# Altium project SISPS-PV-PCB.PrjPcb (part 1 of 4)
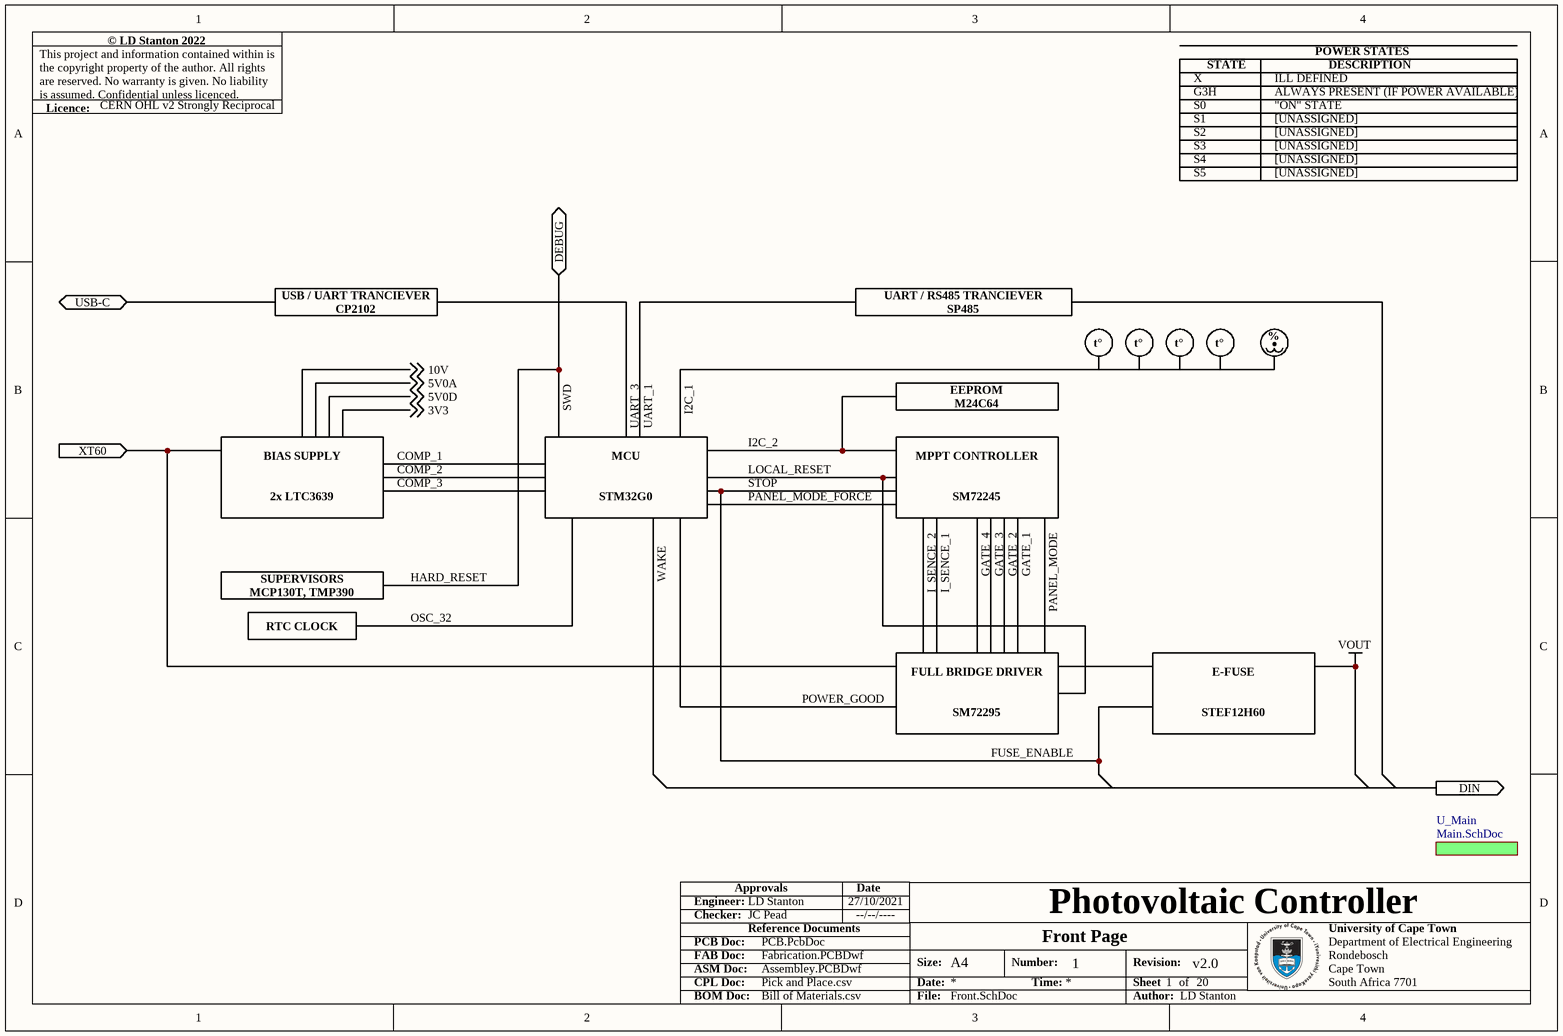
[diagram p0: Front.SchDoc]
Approv_Date_Chk: --/--/----; Approv_Date_Eng: 27/10/2021; ASM_DOC: Assembley.PCBDwf; BOM_DOC: Bill of Materials.csv; Checker: JC Pead; CPL_DOC: Pick and Place.csv; DwgTitleLine1: SISPS-PV; DwgTitleLine2: Photovoltaic MPPT Converter; FAB_DOC: Fabrication.PCBDwf; Licence: CERN OHL v2 Strongly Reciprocal; PCB_DOC: PCB.PcbDoc; Project_Revision: v2.0; Rev_Date_1: 18/10/2021; Rev_Date_2: 27/10/2021; Rev_Date_3: --/--/----; Rev_Date_4: --/--/----; Rev_Desc_1: Initial Prototype; Rev_Desc_2: Change to JLCPCB; Rev_Desc_3: - - - - -; Rev_Desc_4: - - - - -; Rev_No_1: v1.0; Rev_No_2: v1.2; Rev_No_3: -; Rev_No_4: -; SCH_DOC: Main.SchDoc
20 sheets, 532 parts. Net scope: hierarchical (ports join the sheet entries above them; power ports are global).
Board file: PCB.PcbDoc
Sheets:
  Front.SchDoc
    U_Main = Main.SchDoc
      U_MCU = MCU.SchDoc
        U_RS485 Tranciever = RS485 Tranciever.SchDoc
        U_EEPROM = EEPROM.SchDoc
        U_Sensors = Sensors.SchDoc
      U_Connectors = Connectors.SchDoc
      U_Controller = Controller.SchDoc
      U_Bridge Regulator = Bridge Regulator.SchDoc
        U_Panel Mode Switch = Panel Mode Switch.SchDoc
        U_E-Fuse = E-Fuse.SchDoc
      U_Bias Regulators 1 = Bias Regulators 1.SchDoc
      U_Bias Regulators 2 = Bias Regulators 2.SchDoc
      U_Backplane = Backplane.SchDoc
      U_Mechanical = Mechanical.SchDoc
      U_USB-UART Converter (CP2102) = USB-UART Converter (CP2102).SchDoc
  USB-UART Converter (FT232).SchDoc
  Illustrations 1.SchDoc
  Illustrations 2.SchDoc
  Simulation 1.SchDoc

## Sheet Front.SchDoc: Front Page
size A4; ApprovedBy: LD Stanton; Author: LD Stanton; CompanyName: University of Cape Town; DrawnBy: Lawrence Stanton; Engineer: LD Stanton; Organization: University of Cape Town; Address1: Department of Electrical Engineering; Address2: Rondebosch; Address3: Cape Town; Address4: South Africa 7701; DocumentNumber: 1; SheetNumber: 1; SheetTotal: 20; Project_Name: Photovoltaic Controller

### Parts
(Parts that share a designator on the sheet are numbered #1, #2 ... from top to bottom, then left to right.)
?#1  Text Box Small 2 Line Extra Wide Illustration  (value not drawn)  (graphical)
?#2  Text Box Small 2 Line 2X Wide Illustration  (value not drawn)  (graphical)
?#3  Text Box Small 2 Line Extra Wide Illustration  (value not drawn)  (graphical)
?#4  Text Box Large 2 Line Illustration  (value not drawn)  (graphical)
?#5  Text Box Large 2 Line Illustration  (value not drawn)  (graphical)
?#6  Text Box Large 2 Line Illustration  (value not drawn)  (graphical)
?#7  Text Box Small 2 Line Extra Wide Illustration  (value not drawn)  (graphical)
?#8  Text Box Small 1 Line Wide Illustration  (value not drawn)  (graphical)
?#9  Text Box Large 2 Line Illustration  (value not drawn)  (graphical)
?#10  Text Box Large 2 Line Illustration  (value not drawn)  (graphical)
M?#1  Thermometer Illustration  (value not drawn)  (graphical)
M?#2  Thermometer Illustration  (value not drawn)  (graphical)
M?#3  Thermometer Illustration  (value not drawn)  (graphical)
M?#4  Thermometer Illustration  (value not drawn)  (graphical)
M?#5  Humidity Illustration  (value not drawn)  (graphical)

### Sub-sheets
U_Main = Main.SchDoc: no entries

### Ports
DEBUG (bidir), DIN (out), USB-C (bidir), XT60 (in)

### Nets
VOUT: ?#10.35
3V3: ?#4.31 ; off-sheet 3V3
5V0A: ?#4.29 ; off-sheet 5V0A
5V0D: ?#4.30 ; off-sheet 5V0D
10V: ?#4.28 ; off-sheet 10V
COMP_1: ?#4.36 ?#5.58
COMP_2: ?#4.37 ?#5.56
COMP_3: ?#4.38 ?#5.54 ?#5.55
FUSE_ENABLE: ?#5.38 ?#6.54 ?#6.55 ?#10.54 ?#10.55  [also labelled STOP]
GATE_1: ?#6.43 ?#9.31
GATE_2: ?#6.44 ?#9.30
GATE_3: ?#6.45 ?#9.29
GATE_4: ?#6.46 ?#9.28
HARD_RESET: ?#5.23 ?#7.23 ; port DEBUG  [also labelled SWD]
I2C_1: ?#5.32 M?#1.1 M?#2.1 M?#3.1 M?#4.1 M?#5.1
I2C_2: ?#3.26 ?#5.35 ?#5.36 ?#6.57 ?#6.58
I_SENCE_1: ?#6.49 ?#9.25
I_SENCE_2: ?#6.50 ?#9.24
LOCAL_RESET: ?#5.37 ?#6.56 ?#9.37
OSC_32: ?#5.50 ?#8.7
PANEL_MODE: ?#6.41 ?#9.33
PANEL_MODE_FORCE: ?#5.39 ?#6.53
POWER_GOOD: ?#5.42 ?#9.54 ?#9.55
UART_1: ?#2.31 ?#5.29 ?#5.30
UART_3: ?#1.23 ?#5.25 ?#5.26 ?#5.27 ?#5.28
WAKE: ?#5.44
Net?#1_10: ?#1.10 ?#1.11 ?#1.12 ?#1.18
Net?#1_26: ?#1.26 ; port USB-C
Net?#4_54: ?#4.54 ?#4.55
Net?#4_57: ?#4.57 ?#9.57 ; port XT60
Net?#9_35: ?#9.35 ?#9.36 ?#10.57

Not connected (* = marked no-connect by the designer): ?#1 2 3 4 5 6 8 9 14 15 16 17 19 20 21 22 24 25 27 28 29 30 31; ?#2 2 3 4 5 6 8 9 10 11 12 14 15 16 17 18 19 20 21 22 24 25 27 28 29 30 32 33 34 35 36 37 38 39 40 41; ?#3 2 3 4 5 6 8 9 10 11 12 14 15 16 17 18 19 20 21 22 23 24 25 27 28 29 30 31; ?#4 22 23 24 25 26 27 32 33 34 35 39 40 41 42 43 44 45 46 47 48 49 50 51 52 53 56 58; ?#5 22 24 31 33 34 40 41 43 45 46 47 48 49 51 52 53 57; ?#6 22 23 24 25 26 27 28 29 30 31 32 33 34 35 36 37 38 39 40 42 47 48 51 52; ?#7 2 3 4 5 6 8 9 10 11 12 14 15 16 17 18 19 20 21 22 24 25 26 27 28 29 30 31; ?#8 2 3 4 5 6 8 9 10 11 12 13 14 15 16 17 18 19 20 21; ?#9 22 23 26 27 32 34 38 39 40 41 42 43 44 45 46 47 48 49 50 51 52 53 56; ?#10 22 23 24 25 26 27 28 29 30 31 32 33 34 36 37 38 39 40 41 42 43 44 45 46 47 48 49 50 51 52 53 56

### Notes on the sheet
- G3H
- S0
- X
- STATE
- ALWAYS PRESENT (IF POWER AVAILABLE)
- "ON" STATE
- ILL DEFINED
- POWER STATES
- DESCRIPTION
- S1
- S2
- S3
- S4
- S5
- [UNASSIGNED]
- © LD Stanton 2022
- This project and information contained within is the copyright property of the author. All rights are reserved. No warranty is given. No liability is assumed. Confidential unless licenced.
- Licence:
- Engineer:
- Checker:
- Approvals
- Date
- PCB Doc:
- ASM Doc:
- FAB Doc:
- CPL Doc:
- Reference Documents
- Size:
- Date:
- A4
- Number:
- Time:
- Revision:
- Sheet
- of
- BOM Doc:
- File:
- Author:
- (in symbol CMP-00041-1) t°
- (in symbol CMP-00087-1) %

### Library data of the parts
?#1 = CMP-00085-2: Generic Text Box Extra Wide 2 Line Wide for Illustration; Line2: CP2102; Line1: USB / UART TRANCIEVER
?#2 = CMP-00086-1: Generic Text Box 2X Wide 2 Line Wide for Illustration; Line1: UART / RS485 TRANCIEVER; Line2: SP485
?#3 = CMP-00085-2: Generic Text Box Extra Wide 2 Line Wide for Illustration; Line2: M24C64; Line1: EEPROM
?#4 = CMP-00080-3: Generic Text Box Large 2 Line for Illustration; Line2: 2x LTC3639; Line1: BIAS SUPPLY
?#5 = CMP-00080-3: Generic Text Box Large 2 Line for Illustration; Line2: STM32G0; Line1: MCU
?#6 = CMP-00080-3: Generic Text Box Large 2 Line for Illustration; Line2: SM72245; Line1: MPPT CONTROLLER
?#7 = CMP-00085-2: Generic Text Box Extra Wide 2 Line Wide for Illustration; Line2: MCP130T, TMP390; Line1: SUPERVISORS
?#8 = CMP-00088-1: Generic Text Box Small 1 Line Wide for Illustration; Line1: RTC CLOCK
?#9 = CMP-00080-2: Generic Text Box Large 2 Line for Illustration; Line2: SM72295; Line1: FULL BRIDGE DRIVER
?#10 = CMP-00080-2: Generic Text Box Large 2 Line for Illustration; Line2: STEF12H60; Line1: E-FUSE
M?#1-M?#4 = CMP-00041-1: Thermometer for Illustration; Placement: CRITICAL
M?#5 = CMP-00087-1: Humidity Sensor for Illustration; Placement: CRITICAL

## Sheet Main.SchDoc: Main Schematic
size A3; ApprovedBy: LD Stanton; CheckedBy: None; Author: LD Stanton; DrawnBy: LD Stanton; Engineer: LD Stanton; Organization: University of Cape Town; Address1: Department of Electrical Engineering; Address2: Menzies Building, Upper Campus; Address3: Cape Town, South Africa; Address4: 7701; DocumentNumber: 2; Revision: v1.0; SheetNumber: 2; SheetTotal: 20; Project_Name: Photovoltaic Controller
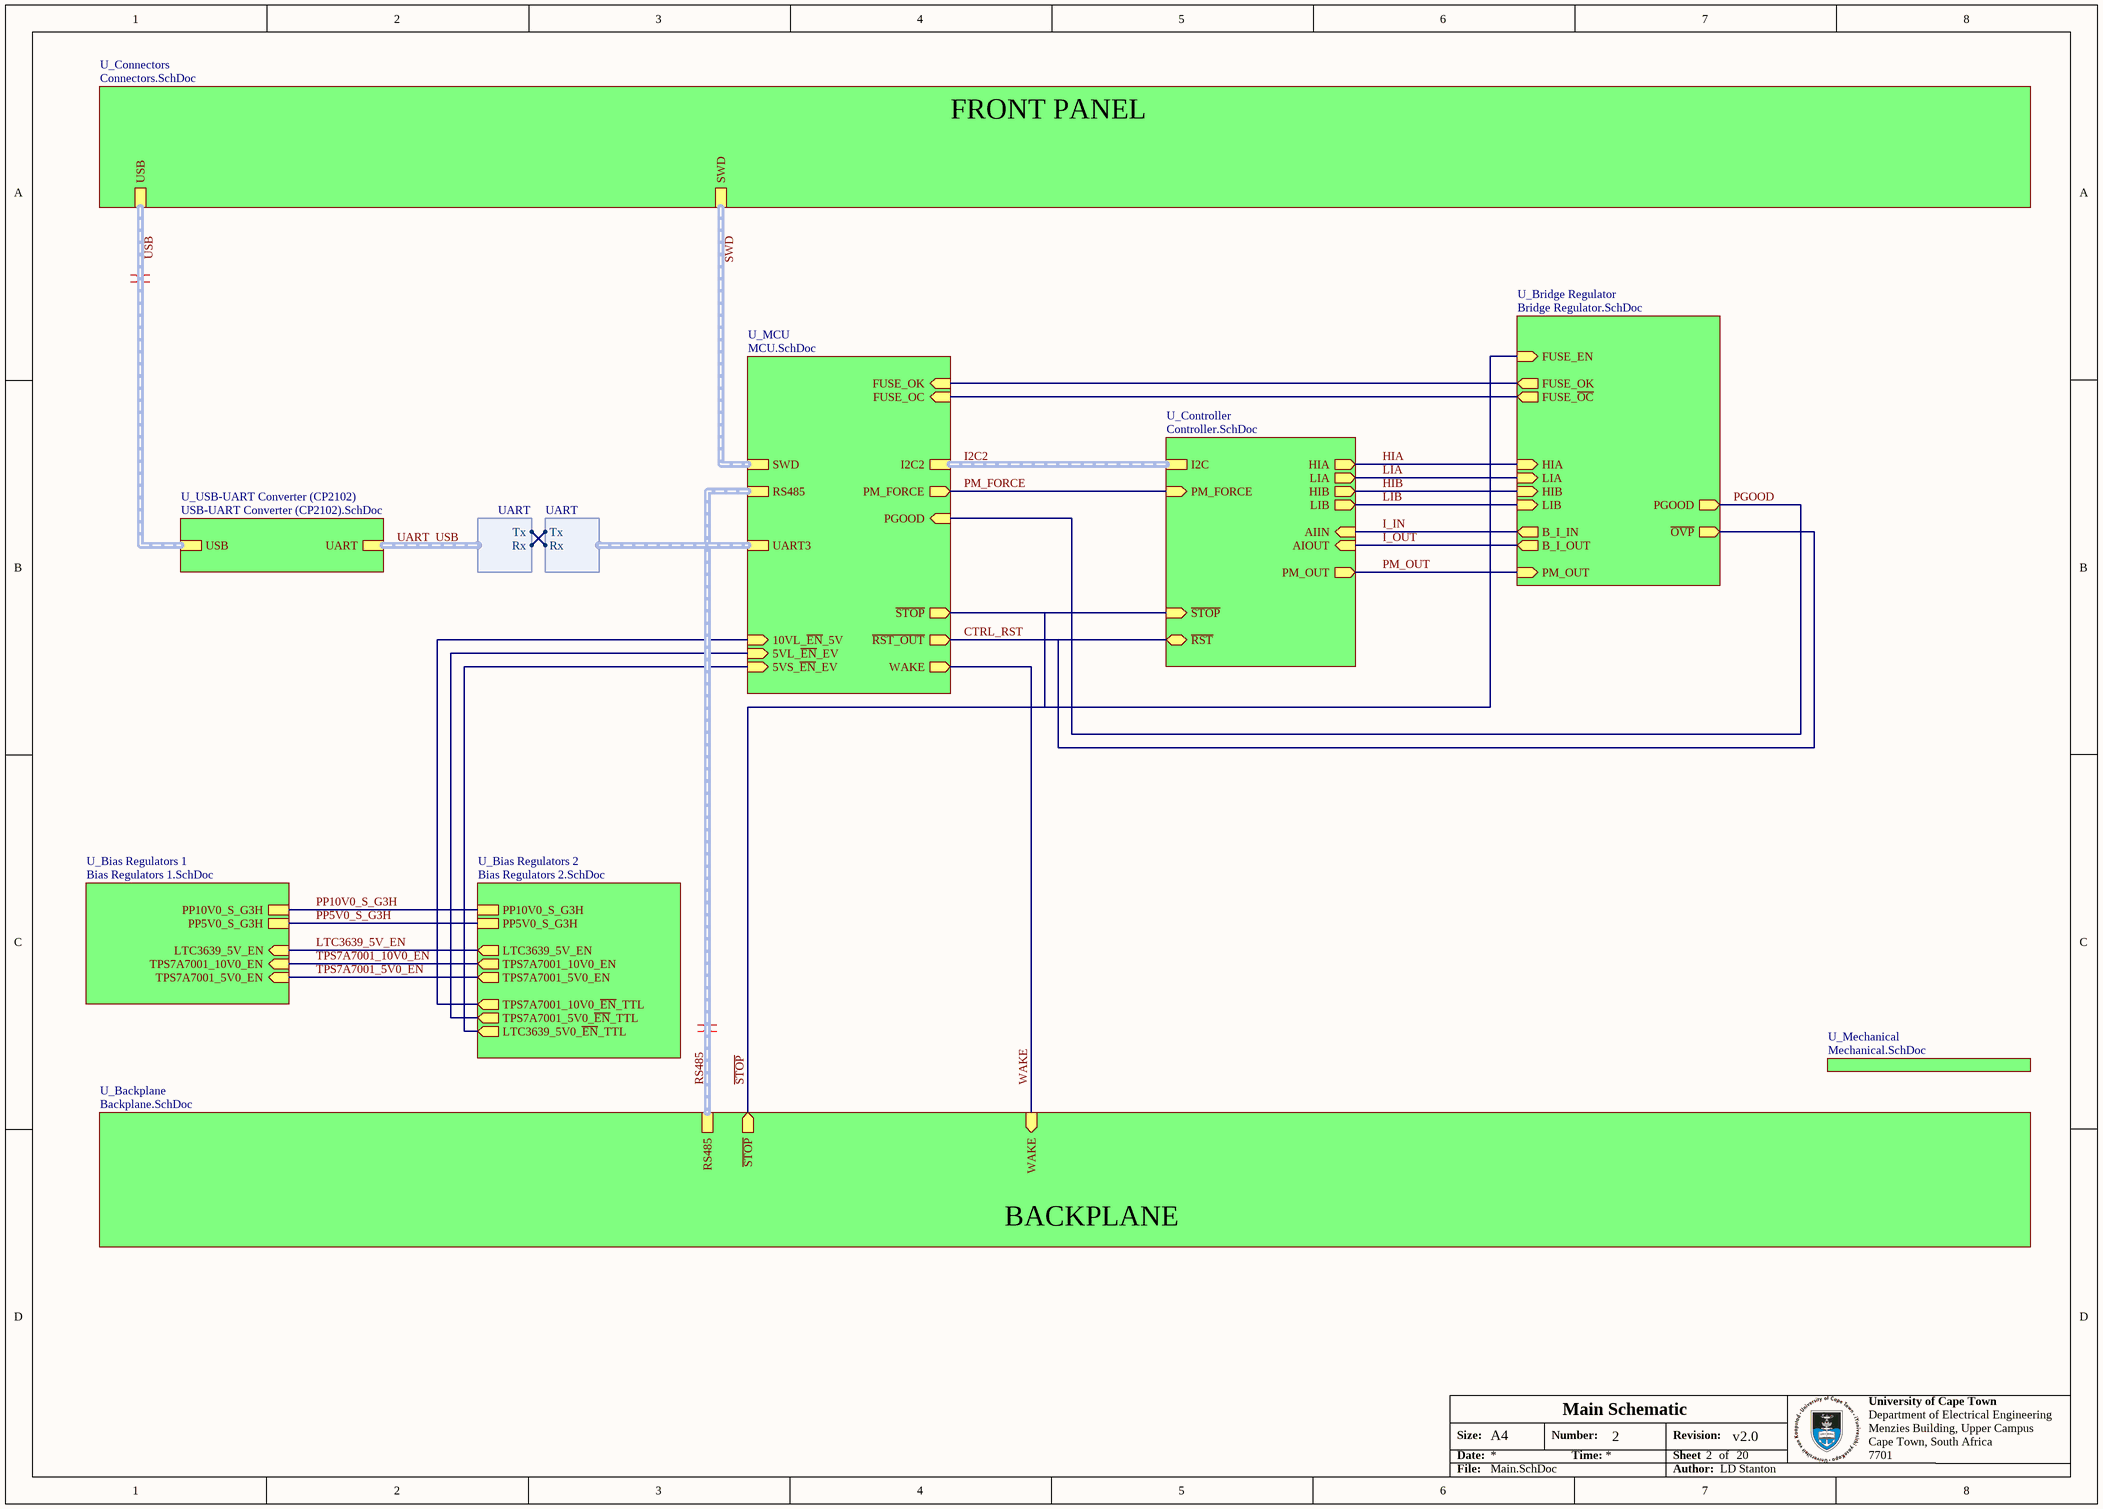
[diagram p1: Main.SchDoc]

### Sub-sheets
U_Backplane = Backplane.SchDoc: RS485 (harness RS485), ~{STOP} (out), WAKE (in)
U_Bias Regulators 1 = Bias Regulators 1.SchDoc: PP10V0_S_G3H, TPS7A7001_5V0_EN (in), LTC3639_5V_EN (in), TPS7A7001_10V0_EN (in), PP5V0_S_G3H
U_Bias Regulators 2 = Bias Regulators 2.SchDoc: PP5V0_S_G3H, PP10V0_S_G3H, LTC3639_5V_EN (out), TPS7A7001_10V0_EN (out), TPS7A7001_5V0_EN (out), TPS7A7001_10V0_~{EN}_TTL (out), LTC3639_5V0_~{EN}_TTL (out), TPS7A7001_5V0_~{EN}_TTL (out)
U_Bridge Regulator = Bridge Regulator.SchDoc: LIA (in), HIA (in), HIB (in), LIB (in), B_I_IN (out), B_I_OUT (out), PGOOD (out), ~{OVP} (out), PM_OUT (in), FUSE_EN (in), FUSE_OK (out), FUSE_~{OC} (out)
U_Connectors = Connectors.SchDoc: USB (harness USB), SWD (harness SWD)
U_Controller = Controller.SchDoc: LIB (out), HIA (out), I2C (harness I2C), PM_OUT (out), AIIN (in), AIOUT (in), ~{RST} (bidir), HIB (out), LIA (out), PM_FORCE (in), ~{STOP} (in)
U_MCU = MCU.SchDoc: SWD (harness SWD), UART3 (harness UART), ~{RST_OUT} (out), PM_FORCE (out), WAKE (out), RS485 (harness RS485), I2C2 (harness I2C), FUSE_OK (in), ~{STOP} (out), FUSE_OC (in), PGOOD (in), 5VS_~{EN}_EV (in), 10VL_~{EN}_5V (in), 5VL_~{EN}_EV (in)
U_Mechanical = Mechanical.SchDoc: no entries
U_USB-UART Converter (CP2102) = USB-UART Converter (CP2102).SchDoc: USB (harness USB), UART (harness UART)

### Harnesses
UART: Rx, Tx

### Nets
~{STOP}: sheet U_MCU/~{STOP}, sheet U_Controller/~{STOP}, sheet U_Bridge Regulator/FUSE_EN, sheet U_Backplane/~{STOP}
CTRL_RST: sheet U_MCU/~{RST_OUT}, sheet U_Controller/~{RST}, sheet U_Bridge Regulator/~{OVP}
FUSE_OC: sheet U_MCU/FUSE_OC, sheet U_Bridge Regulator/FUSE_~{OC}
FUSE_OK: sheet U_MCU/FUSE_OK, sheet U_Bridge Regulator/FUSE_OK
HIA: sheet U_Controller/HIA, sheet U_Bridge Regulator/HIA
HIB: sheet U_Controller/HIB, sheet U_Bridge Regulator/HIB
I_IN: sheet U_Controller/AIIN, sheet U_Bridge Regulator/B_I_IN
I_OUT: sheet U_Controller/AIOUT, sheet U_Bridge Regulator/B_I_OUT
LIA: sheet U_Controller/LIA, sheet U_Bridge Regulator/LIA
LIB: sheet U_Controller/LIB, sheet U_Bridge Regulator/LIB
LTC3639_5V_EN: sheet U_Bias Regulators 1/LTC3639_5V_EN, sheet U_Bias Regulators 2/LTC3639_5V_EN
PGOOD: sheet U_MCU/PGOOD, sheet U_Bridge Regulator/PGOOD
PM_FORCE: sheet U_MCU/PM_FORCE, sheet U_Controller/PM_FORCE
PM_OUT: sheet U_Controller/PM_OUT, sheet U_Bridge Regulator/PM_OUT
PP5V0_S_G3H: sheet U_Bias Regulators 1/PP5V0_S_G3H, sheet U_Bias Regulators 2/PP5V0_S_G3H
PP10V0_S_G3H: sheet U_Bias Regulators 1/PP10V0_S_G3H, sheet U_Bias Regulators 2/PP10V0_S_G3H
TPS7A7001_5V0_EN: sheet U_Bias Regulators 1/TPS7A7001_5V0_EN, sheet U_Bias Regulators 2/TPS7A7001_5V0_EN
TPS7A7001_10V0_EN: sheet U_Bias Regulators 1/TPS7A7001_10V0_EN, sheet U_Bias Regulators 2/TPS7A7001_10V0_EN
UART_USB.Rx: sheet U_USB-UART Converter (CP2102)/UART.Rx, sheet U_MCU/UART3.Tx
UART_USB.Tx: sheet U_USB-UART Converter (CP2102)/UART.Tx, sheet U_MCU/UART3.Rx
WAKE: sheet U_MCU/WAKE, sheet U_Backplane/WAKE
NetR408_2: sheet U_MCU/5VS_~{EN}_EV, sheet U_Bias Regulators 2/LTC3639_5V0_~{EN}_TTL
NetR409_2: sheet U_MCU/5VL_~{EN}_EV, sheet U_Bias Regulators 2/TPS7A7001_5V0_~{EN}_TTL
NetR410_2: sheet U_MCU/10VL_~{EN}_5V, sheet U_Bias Regulators 2/TPS7A7001_10V0_~{EN}_TTL

### Buses and harness runs
harness I2C2 = sheet U_Controller/I2C = sheet U_MCU/I2C2
harness RS485 = sheet U_Backplane/RS485 = sheet U_MCU/RS485
harness SWD = sheet U_Connectors/SWD = sheet U_MCU/SWD
harness UART_USB = sheet U_USB-UART Converter (CP2102)/UART
harness USB = sheet U_Connectors/USB = sheet U_USB-UART Converter (CP2102)/USB

### Layout directives
differential pair: (no net found under the mark)

### Notes on the sheet
- FRONT PANEL
- BACKPLANE
- Size:
- Date:
- A4
- Number:
- Time:
- Revision:
- Sheet
- of
- File:
- Author:

## Sheet MCU.SchDoc: MCU
size A3; ApprovedBy: LD Stanton; Author: LD Stanton; CompanyName: University of Cape Town; DrawnBy: Lawrence Stanton; Engineer: Lawrence Stanton; Organization: University of Cape Town; Address1: Department of Electrical Engineering; Address2: Rondebosch; Address3: Cape Town; Address4: South Africa 7701; DocumentNumber: 11; SheetNumber: 11; SheetTotal: 20
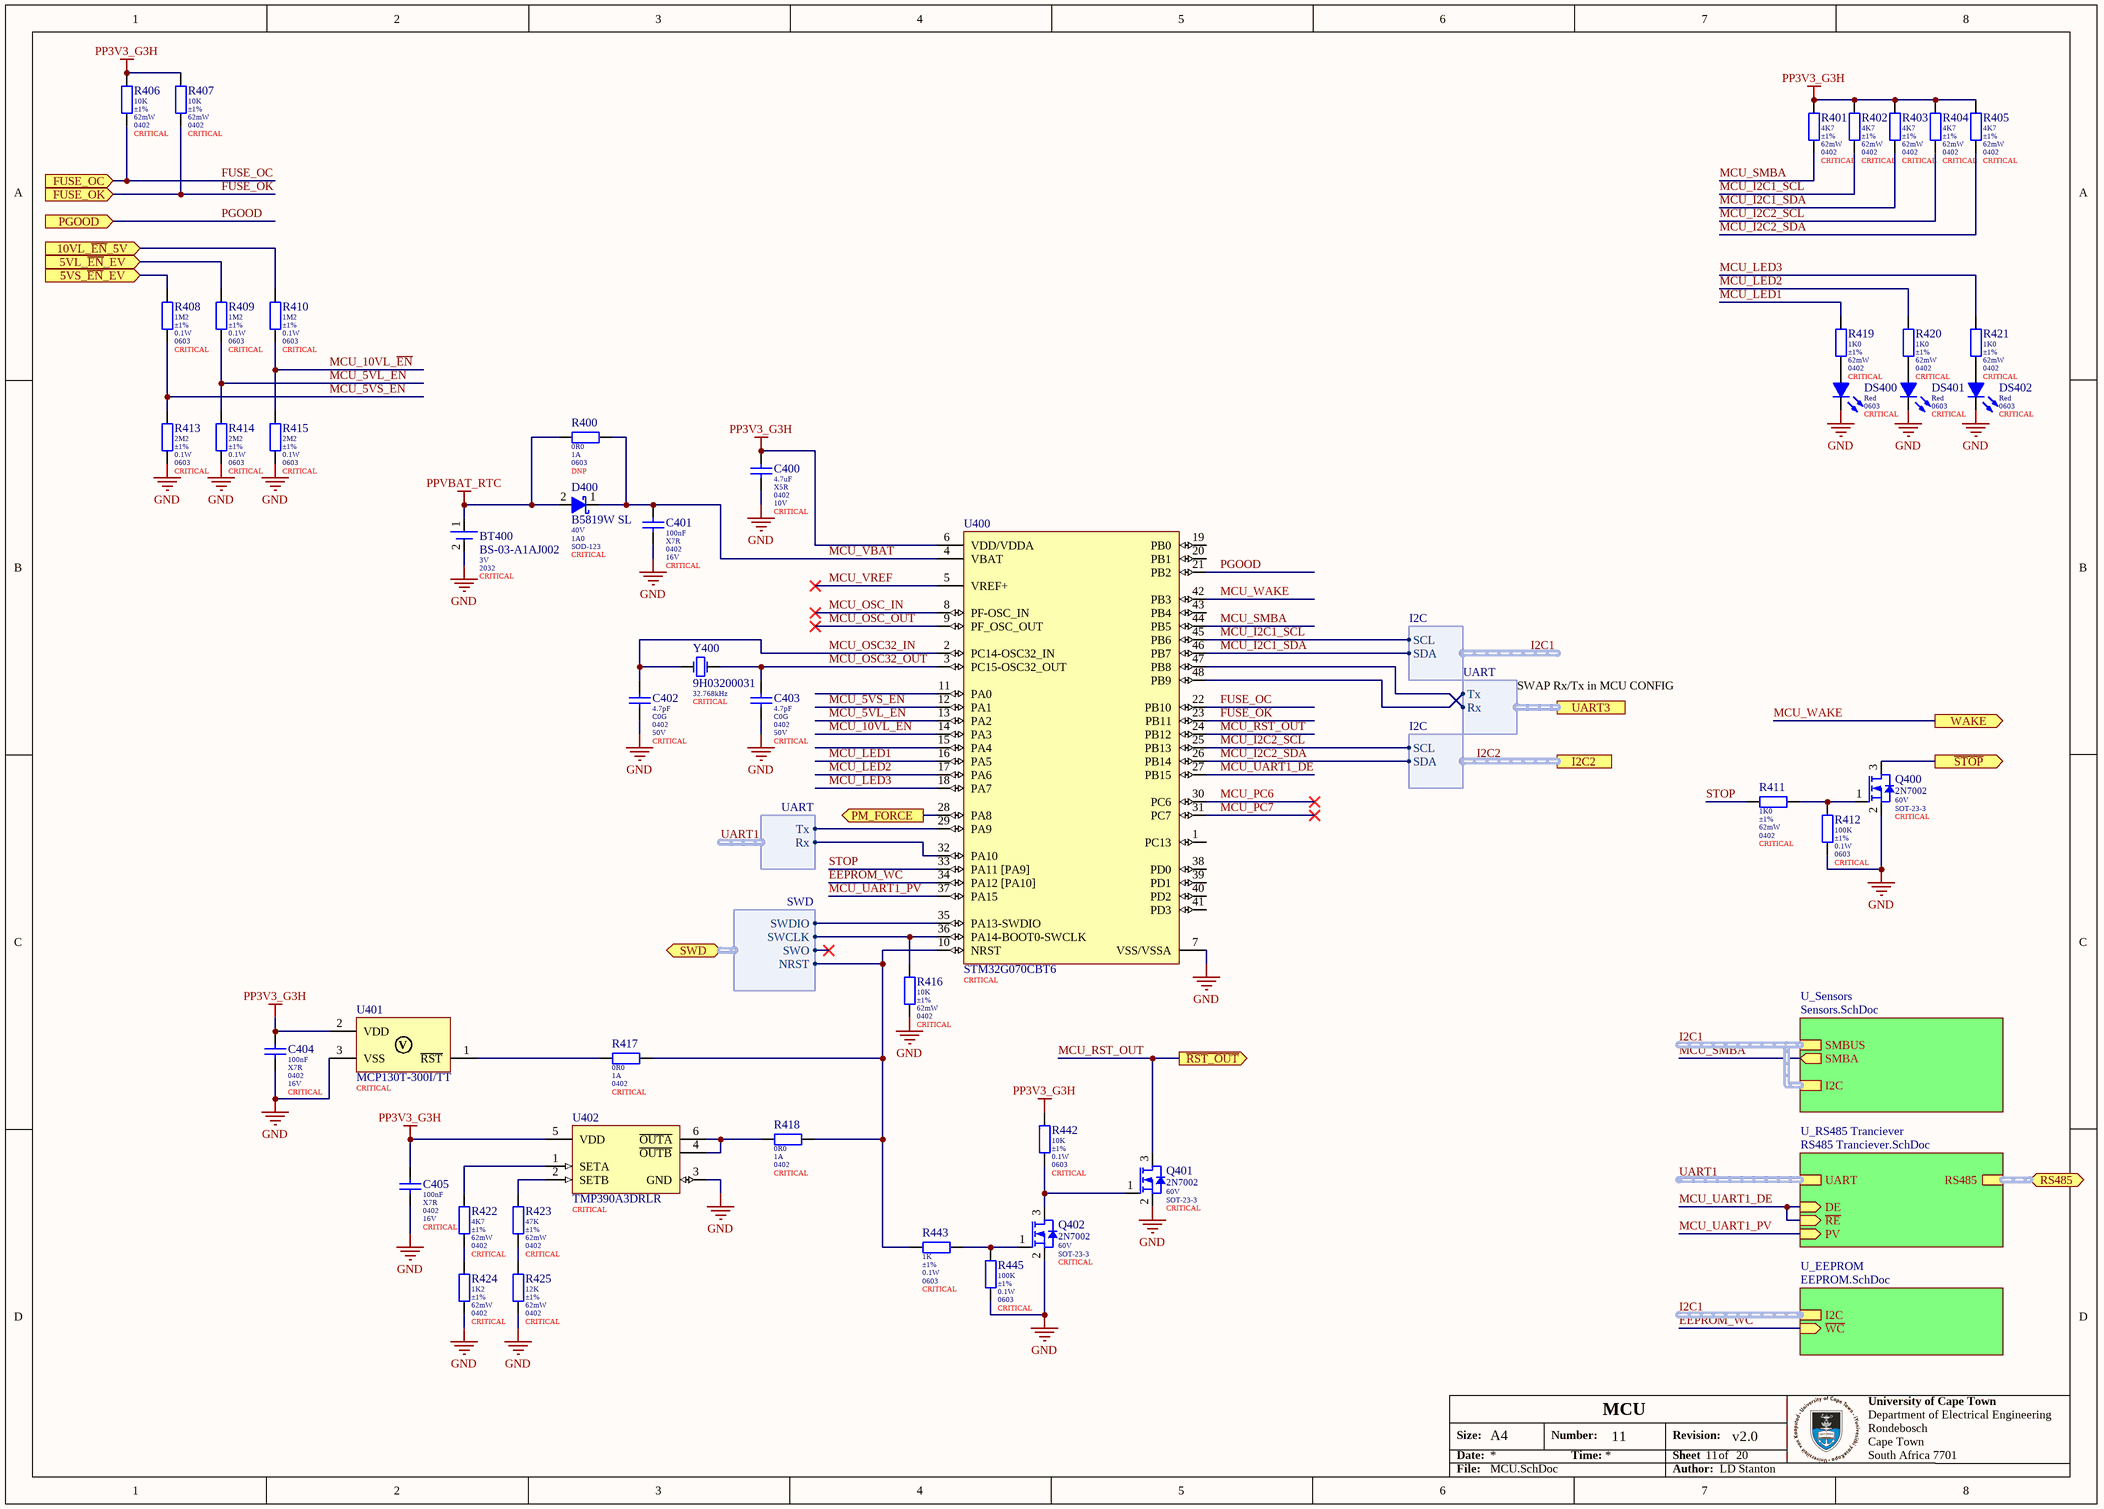
[diagram p2: MCU.SchDoc]

### Parts
BT400  BS-03-A1AJ002  value 3V  Package: 2032  Placement: CRITICAL  [BS-03-A1AJ002-Footprint-1]
C400  value 4.7uF  Dielectric: X5R  Package: 0402  Voltage: 10V  Populate: CRITICAL  [0402_050_5 (Samsumg) B]  (hidden comment: CL05A475MP5NRNC)
C401  value 100nF  Dielectric: X7R  Package: 0402  Voltage: 16V  Populate: CRITICAL  [0402_050_5 (Samsumg) B]  (hidden comment: CL05B104KO5NNNC)
C402  value 4.7pF  Dielectric: C0G  Package: 0402  Voltage: 50V  Populate: CRITICAL  [0402_050 (Guandong) B]  (hidden comment: 0402CG4R7C500NT)
C403  value 4.7pF  Dielectric: C0G  Package: 0402  Voltage: 50V  Populate: CRITICAL  [0402_050 (Guandong) B]  (hidden comment: 0402CG4R7C500NT)
C404  value 100nF  Dielectric: X7R  Package: 0402  Voltage: 16V  Populate: CRITICAL  [0402_050_5 (Samsumg) B]  (hidden comment: CL05B104KO5NNNC)
C405  value 100nF  Dielectric: X7R  Package: 0402  Voltage: 16V  Populate: CRITICAL  [0402_050_5 (Samsumg) B]  (hidden comment: CL05B104KO5NNNC)
D400  B5819W SL  Blocking Voltage: 40V  Forward Current: 1A0  Package: SOD-123  Placement: CRITICAL  [SOD-123 (JCET) B]
DS400  Colour: Red  Package: 0603  Placement: CRITICAL  [LED 0603 (Everlight) B]  (hidden comment: 19-217/R6C-AL1M2VY/3T)
DS401  Colour: Red  Package: 0603  Placement: CRITICAL  [LED 0603 (Everlight) B]  (hidden comment: 19-217/R6C-AL1M2VY/3T)
DS402  Colour: Red  Package: 0603  Placement: CRITICAL  [LED 0603 (Everlight) B]  (hidden comment: 19-217/R6C-AL1M2VY/3T)
Q400  2N7002  Maximum Drain Source Voltage: 60V  Package: SOT-23-3  Placement: CRITICAL  [SOT-23-3 (2N7002) B]
Q401  2N7002  Maximum Drain Source Voltage: 60V  Package: SOT-23-3  Placement: CRITICAL  [SOT-23-3 (2N7002) B]
Q402  2N7002  Maximum Drain Source Voltage: 60V  Package: SOT-23-3  Placement: CRITICAL  [SOT-23-3 (2N7002) B]
R400  value 0R0  Current: 1A  Package: 0603  Populate: DNP  [0603 (Uniroyal) B]  (hidden comment: 0603WAF0000T5E)
R401  value 4K7  Tolerance: ±1%  Power: 62mW  Package: 0402  Populate: CRITICAL  [0402 (Uniroyal) B]  (hidden comment: 0402WGF4701TCE)
R402  value 4K7  Tolerance: ±1%  Power: 62mW  Package: 0402  Populate: CRITICAL  [0402 (Uniroyal) B]  (hidden comment: 0402WGF4701TCE)
R403  value 4K7  Tolerance: ±1%  Power: 62mW  Package: 0402  Populate: CRITICAL  [0402 (Uniroyal) B]  (hidden comment: 0402WGF4701TCE)
R404  value 4K7  Tolerance: ±1%  Power: 62mW  Package: 0402  Populate: CRITICAL  [0402 (Uniroyal) B]  (hidden comment: 0402WGF4701TCE)
R405  value 4K7  Tolerance: ±1%  Power: 62mW  Package: 0402  Populate: CRITICAL  [0402 (Uniroyal) B]  (hidden comment: 0402WGF4701TCE)
R406  value 10K  Tolerance: ±1%  Power: 62mW  Package: 0402  Populate: CRITICAL  [0402 (Uniroyal) B]  (hidden comment: 0402WGF1002TCE)
R407  value 10K  Tolerance: ±1%  Power: 62mW  Package: 0402  Populate: CRITICAL  [0402 (Uniroyal) B]  (hidden comment: 0402WGF1002TCE)
R408  value 1M2  Tolerance: ±1%  Power: 0.1W  Package: 0603  Populate: CRITICAL  [0603 (Uniroyal) B]  (hidden comment: 0603WAF1204T5E)
R409  value 1M2  Tolerance: ±1%  Power: 0.1W  Package: 0603  Populate: CRITICAL  [0603 (Uniroyal) B]  (hidden comment: 0603WAF1204T5E)
R410  value 1M2  Tolerance: ±1%  Power: 0.1W  Package: 0603  Populate: CRITICAL  [0603 (Uniroyal) B]  (hidden comment: 0603WAF1204T5E)
R411  value 1K0  Tolerance: ±1%  Power: 62mW  Package: 0402  Populate: CRITICAL  [0402 (Uniroyal) B]  (hidden comment: 0402WGF1001TCE)
R412  value 100K  Tolerance: ±1%  Power: 0.1W  Package: 0603  Populate: CRITICAL  [0603 (Uniroyal) B]  (hidden comment: 0603WAF1003T5E)
R413  value 2M2  Tolerance: ±1%  Power: 0.1W  Package: 0603  Populate: CRITICAL  [0603 (Uniroyal) B]  (hidden comment: 0603WAF2204T5E)
R414  value 2M2  Tolerance: ±1%  Power: 0.1W  Package: 0603  Populate: CRITICAL  [0603 (Uniroyal) B]  (hidden comment: 0603WAF2204T5E)
R415  value 2M2  Tolerance: ±1%  Power: 0.1W  Package: 0603  Populate: CRITICAL  [0603 (Uniroyal) B]  (hidden comment: 0603WAF2204T5E)
R416  value 10K  Tolerance: ±1%  Power: 62mW  Package: 0402  Populate: CRITICAL  [0402 (Uniroyal) B]  (hidden comment: 0402WGF1002TCE)
R417  value 0R0  Current: 1A  Package: 0402  Populate: CRITICAL  [0402 (Uniroyal) B]  (hidden comment: 0402WGF0000TCE)
R418  value 0R0  Current: 1A  Package: 0402  Populate: CRITICAL  [0402 (Uniroyal) B]  (hidden comment: 0402WGF0000TCE)
R419  value 1K0  Tolerance: ±1%  Power: 62mW  Package: 0402  Populate: CRITICAL  [0402 (Uniroyal) B]  (hidden comment: 0402WGF1001TCE)
R420  value 1K0  Tolerance: ±1%  Power: 62mW  Package: 0402  Populate: CRITICAL  [0402 (Uniroyal) B]  (hidden comment: 0402WGF1001TCE)
R421  value 1K0  Tolerance: ±1%  Power: 62mW  Package: 0402  Populate: CRITICAL  [0402 (Uniroyal) B]  (hidden comment: 0402WGF1001TCE)
R422  value 4K7  Tolerance: ±1%  Power: 62mW  Package: 0402  Populate: CRITICAL  [0402 (Uniroyal) B]  (hidden comment: 0402WGF4701TCE)
R423  value 47K  Tolerance: ±1%  Power: 62mW  Package: 0402  Populate: CRITICAL  [0402 (Uniroyal) B]  (hidden comment: 0402WGF4702TCE)
R424  value 1K2  Tolerance: ±1%  Power: 62mW  Package: 0402  Populate: CRITICAL  [0402 (Uniroyal) B]  (hidden comment: 0402WGF1201TCE)
R425  value 12K  Tolerance: ±1%  Power: 62mW  Package: 0402  Populate: CRITICAL  [0402 (Uniroyal) B]  (hidden comment: 0402WGF1202TCE)
R442  value 10K  Tolerance: ±1%  Power: 0.1W  Package: 0603  Populate: CRITICAL  [0603 (Uniroyal) B]  (hidden comment: 0603WAF1002T5E)
R443  value 1K  Tolerance: ±1%  Power: 0.1W  Package: 0603  Populate: CRITICAL  [0603 (Uniroyal) B]  (hidden comment: 0603WAF1001T5E)
R445  value 100K  Tolerance: ±1%  Power: 0.1W  Package: 0603  Populate: CRITICAL  [0603 (Uniroyal) B]  (hidden comment: 0603WAF1003T5E)
U400  STM32G070CBT6  Placement: CRITICAL  [LQFP48 (STM32G0) B]
U401  MCP130T-300I/TT  Placement: CRITICAL  [SOT23-3 (MCP120) B]
U402  TMP390A3DRLR  Placement: CRITICAL  [SOT56-3 (DRL0006A) B]
Y400  9H03200031  Frequency: 32.768kHz  Placement: CRITICAL  [Crystal 3215 (TXC) B]

### Sub-sheets
U_EEPROM = EEPROM.SchDoc: I2C (harness I2C), ~{WC} (in)
U_RS485 Tranciever = RS485 Tranciever.SchDoc: RS485 (harness RS485), UART (harness UART), DE (in), ~{RE} (in), PV (in)
U_Sensors = Sensors.SchDoc: SMBUS (harness I2C), SMBA (out), I2C (harness I2C)

### Ports
5VL_~{EN}_EV (in), 5VS_~{EN}_EV (in), 10VL_~{EN}_5V (in), FUSE_OC (in), FUSE_OK (in), I2C2 (harness I2C), PGOOD (in), PM_FORCE (out), RS485 (bidir, harness RS485), SWD (bidir, harness SWD), UART3 (harness UART), WAKE (out), ~{RST_OUT} (out), ~{STOP} (out)

### Harnesses
I2C: SCL, SDA
SWD: SWCLK, SWDIO, NRST, SWO
UART: Rx, Tx

### Nets
GND: BT400.2 C400.2 C401.2 C402.2 C403.2 C404.2 C405.2 DS400.K DS401.K DS402.K Q400.2(S) Q401.2(S) Q402.2(S) R412.2 R413.2 R414.2 R415.2 R416.2 R424.2 R425.2 R445.2 U400.7(VSS/VSSA) U401.3(VSS) U402.3(GND)
PP3V3_G3H: C400.1 C404.1 C405.1 R401.1 R402.1 R403.1 R404.1 R405.1 R406.1 R407.1 R442.1 U400.6(VDD/VDDA) U401.2(VDD) U402.5(VDD)
PPVBAT_RTC: BT400.1 D400.2(A) R400.1
~{EEPROM_WC}: U400.34(PA12_[PA10]) ; sheet U_EEPROM/~{WC}
~{STOP}: Q400.3(D) ; port ~{STOP}
FUSE_OC: R406.2 U400.22(PB10) ; port FUSE_OC
FUSE_OK: R407.2 U400.23(PB11) ; port FUSE_OK
MCU_5VL_~{EN}: R409.1 R414.1 U400.13(PA2)
MCU_5VS_~{EN}: R408.1 R413.1 U400.12(PA1)
MCU_10VL_~{EN}: R410.1 R415.1 U400.14(PA3)
MCU_I2C1_SCL: R402.2 U400.45(PB6) ; sheet U_EEPROM/I2C.SCL  [project net I2C1.SCL]
MCU_I2C1_SDA: R403.2 U400.46(PB7) ; sheet U_EEPROM/I2C.SDA  [project net I2C1.SDA]
MCU_I2C2_SCL: R404.2 U400.25(PB13) ; port I2C2.SCL  [project net I2C2.SCL]
MCU_I2C2_SDA: R405.2 U400.26(PB14) ; port I2C2.SDA  [project net I2C2.SDA]
MCU_LED1: R419.1 U400.16(PA5)
MCU_LED2: R420.1 U400.17(PA6)
MCU_LED3: R421.1 U400.18(PA7)
MCU_OSC32_IN: C402.1 U400.2(PC14-OSC32_IN) Y400.1
MCU_OSC32_OUT: C403.1 U400.3(PC15-OSC32_OUT) Y400.2
MCU_OSC_IN: U400.8(PF-OSC_IN)
MCU_OSC_OUT: U400.9(PF_OSC_OUT)
MCU_PC6: U400.30(PC6)
MCU_PC7: U400.31(PC7)
MCU_RST_OUT: Q401.3(D) U400.24(PB12) ; port ~{RST_OUT}  [project net CTRL_RST]
MCU_SMBA: R401.2 U400.44(PB5) ; sheet U_Sensors/SMBA
MCU_UART1_DE: U400.27(PB15) ; sheet U_RS485 Tranciever/DE, sheet U_RS485 Tranciever/~{RE}
MCU_UART1_PV: U400.37(PA15) ; sheet U_RS485 Tranciever/PV
MCU_VBAT: C401.1 D400.1(K) R400.2 U400.4(VBAT)
MCU_VREF: U400.5(VREF+)
MCU_WAKE: U400.42(PB3) ; port WAKE  [project net WAKE]
PGOOD: U400.21(PB2) ; port PGOOD
PM_FORCE: U400.28(PA8) ; port PM_FORCE
STOP: R411.1 U400.33(PA11_[PA9])
SWD.NRST: R417.2 R418.2 R443.1 U400.10(NRST) ; port SWD.NRST
SWD.SWCLK: R416.1 U400.36(PA14-BOOT0-SWCLK) ; port SWD.SWCLK
SWD.SWDIO: U400.35(PA13-SWDIO) ; port SWD.SWDIO
UART1.Rx: U400.32(PA10) ; sheet U_RS485 Tranciever/UART.Rx
UART1.Tx: U400.29(PA9) ; sheet U_RS485 Tranciever/UART.Tx
UART_USB.Rx: U400.48(PB9) ; port UART3.Tx
UART_USB.Tx: U400.47(PB8) ; port UART3.Rx
NetDS400_A: DS400.A R419.2
NetDS401_A: DS401.A R420.2
NetDS402_A: DS402.A R421.2
NetQ400_1: Q400.1(G) R411.2 R412.1
NetQ401_1: Q401.1(G) Q402.3(D) R442.2
NetQ402_1: Q402.1(G) R443.2 R445.1
NetR408_2: R408.2 ; port 5VS_~{EN}_EV
NetR409_2: R409.2 ; port 5VL_~{EN}_EV
NetR410_2: R410.2 ; port 10VL_~{EN}_5V
NetR417_1: R417.1 U401.1(~{RST})
NetR418_1: R418.1 U402.4(~{OUTB}) U402.6(~{OUTA})
NetR422_1: R422.1 U402.1(SETA)
NetR422_2: R422.2 R424.1
NetR423_1: R423.1 U402.2(SETB)
NetR423_2: R423.2 R425.1

Not connected (* = marked no-connect by the designer): U400 1(PC13) 11(PA0) 15(PA4) 19(PB0) 20(PB1) 38(PD0) 39(PD1) 40(PD2) 41(PD3) 43(PB4)

### Buses and harness runs
harness I2C1 = sheet U_EEPROM/I2C
harness I2C1 = sheet U_Sensors/I2C = sheet U_Sensors/SMBUS
harness I2C2 = port I2C2
harness port RS485 = sheet U_RS485 Tranciever/RS485
harness UART1 = sheet U_RS485 Tranciever/UART

### Notes on the sheet
- SWAP Rx/Tx in MCU CONFIG
- Size:
- Date:
- A4
- Number:
- Time:
- Revision:
- Sheet
- of
- File:
- Author:
- (in symbol CMP-000036-4) V

### Library data of the parts
BT400 = CMP-002-00001-3: Coin Cell Battery Holder 2032; LCSC Part Number: C964748; ComponentLink1Description: Drawing; ComponentLink1URL: https://datasheet.lcsc.com/lcsc/2012181808_MYOUNG-BS-03-A1AJ002_C964748.pdf
C400 = CMP-045-000019-8: MLCC 4.7uF 0402 10V X5R ±20%; Manufacturer: Samsung; ComponentLink1URL: https://datasheet.lcsc.com/szlcsc/Samsung-Electro-Mechanics-CL05C100JB5NNNC_C32949.pdf; Tolerance: ±20%; LCSC Part Number: C23733; ComponentLink1Description: Datasheet
C401 C404 C405 = CMP-045-000014-12: MLCC 100nF 0402 16V X7R ±10%; Manufacturer: Samsung; ComponentLink1Description: Datasheet; ComponentLink1URL: https://datasheet.lcsc.com/szlcsc/Samsung-Electro-Mechanics-CL05C100JB5NNNC_C32949.pdf; LCSC Part Number: C1525; Tolerance: ±10%
C402 C403 = CMP-014-000013-1: MLCC 4.7pF 0402 50V C0G ±0.25pF; Manufacturer: Guandong; ComponentLink1URL: https://datasheet.lcsc.com/szlcsc/Guangdong-Fenghua-Advanced-Tech-0402B102K500NT_C1523.pdf; ComponentLink1Description: Datasheet; LCSC Part Number: C1569; Tolerance: ±0.25pF
D400 = CMP-022-000009-2: Schottky Barrier Diode 40V 1A 600mV SOD-123 JCET; ComponentLink1URL: https://datasheet.lcsc.com/lcsc/1809140216_Changjiang-Electronics-Tech--CJ-B5819W-SL_C8598.pdf; LCSC Part Number: C8598; ComponentLink1Description: Datasheet
DS400-DS402 = CMP-007-00000-1: LED 0603 SMT Red; Manufacturer: Everlight; Maximum Forward Current: 20mA; Forward Voltage: 2.2V; ComponentLink1Description: Datasheet; RoHS Compliant: Yes; ComponentLink1URL: https://datasheet.lcsc.com/lcsc/1811101510_Everlight-Elec-19-217-R6C-AL1M2VY-3T_C72044.pdf; LCSC Part Number: C72044
Q400-Q402 = CMP-040-000000-14: Small Signal MOSFET, 500 mA, 60 V, N-Channel, Enhancement, JCET SOT-23-3; Gate Threshold Voltage: 2V5; Power: 0.225W; Maximum Drain Current: 0.2A; Maximum Gate Source Voltage: ±20V; Drain-Source On Resistance: 7R; ComponentLink1Description: Datasheet; LCSC Part Number: C8545; ComponentLink1URL: https://datasheet.lcsc.com/szlcsc/Changjiang-Electronics-Tech-CJ-2N7002_C8545.pdf; Manufacturer: JCET
R400 = CMP-010-000359-7: Jumper 0603 1A Uniroyal; Pin Count: 2; ComponentLink1URL: https://datasheet.lcsc.com/szlcsc/1811062009_UNI-ROYAL-Uniroyal-Elec-0603WAF1002T5E_C25804.pdf; Manufacturer: Uniroyal; LCSC Part Number: C21189; Temperature: -55 - 155°C; ComponentLink1Description: Datasheet
R401-R405 R422 = CMP-010-000338-12: Resistor 4K7 0402 ±1% Thick Film Uniroyal; Temperature Coefficient: ±100ppm/K; Working Voltage: 50V; Temperature: -55 - 155°C; ComponentLink1URL: https://datasheet.lcsc.com/szlcsc/1811062009_UNI-ROYAL-Uniroyal-Elec-0603WAF1002T5E_C25804.pdf; Manufacturer: Uniroyal; LCSC Part Number: C25900; Pin Count: 2; ComponentLink1Description: Datasheet
R406 R407 R416 = CMP-010-000292-12: Resistor 10K 0402 ±1% Thick Film Uniroyal; Working Voltage: 50V; Temperature Coefficient: ±100ppm/K; Manufacturer: Uniroyal; Pin Count: 2; ComponentLink1URL: https://datasheet.lcsc.com/szlcsc/1811062009_UNI-ROYAL-Uniroyal-Elec-0603WAF1002T5E_C25804.pdf; LCSC Part Number: C25744; Temperature: -55 - 155°C; ComponentLink1Description: Datasheet
R408-R410 = CMP-010-000374-4: Resistor 1M2 0603 ±1% Thick Film Uniroyal; Temperature Coefficient: ±100ppm/K; Working Voltage: 75V; Temperature: -55 - 155°C; Pin Count: 2; ComponentLink1URL: https://datasheet.lcsc.com/szlcsc/1811062009_UNI-ROYAL-Uniroyal-Elec-0603WAF1002T5E_C25804.pdf; Manufacturer: Uniroyal; LCSC Part Number: C13315; ComponentLink1Description: Datasheet
R411 R419-R421 = CMP-010-000307-13: Resistor 1K0 0402 ±1% Thick Film Uniroyal; Working Voltage: 50V; Temperature Coefficient: ±100ppm/K; Temperature: -55 - 155°C; ComponentLink1URL: https://datasheet.lcsc.com/szlcsc/1811062009_UNI-ROYAL-Uniroyal-Elec-0603WAF1002T5E_C25804.pdf; Manufacturer: Uniroyal; Pin Count: 2; ComponentLink1Description: Datasheet; LCSC Part Number: C11702
R412 R445 = CMP-010-000288-10: Resistor 100K 0603 ±1% Thick Film Uniroyal; Working Voltage: 75V; Temperature Coefficient: ±100ppm/K; Manufacturer: Uniroyal; ComponentLink1URL: https://datasheet.lcsc.com/szlcsc/1811062009_UNI-ROYAL-Uniroyal-Elec-0603WAF1002T5E_C25804.pdf; LCSC Part Number: C25803; Temperature: -55 - 155°C; ComponentLink1Description: Datasheet; Pin Count: 2
R413-R415 = CMP-010-000383-2: Resistor 2M2 0603 ±1% Thick Film Uniroyal; Temperature Coefficient: ±100ppm/K; Working Voltage: 75V; Temperature: -55 - 155°C; Manufacturer: Uniroyal; Pin Count: 2; LCSC Part Number: C22938; ComponentLink1URL: https://datasheet.lcsc.com/szlcsc/1811062009_UNI-ROYAL-Uniroyal-Elec-0603WAF1002T5E_C25804.pdf; ComponentLink1Description: Datasheet
R417 R418 = CMP-010-000280-15: Jumper 0402 1A Uniroyal; Working Voltage: 50V; ComponentLink1URL: https://datasheet.lcsc.com/szlcsc/1811062009_UNI-ROYAL-Uniroyal-Elec-0603WAF1002T5E_C25804.pdf; Manufacturer: Uniroyal; ComponentLink1Description: Datasheet; LCSC Part Number: C17168; Pin Count: 2; Temperature: -55 - 155°C
R423 = CMP-010-000337-13: Resistor 47K 0402 ±1% Thick Film Uniroyal; Temperature Coefficient: ±100ppm/K; Working Voltage: 50V; Temperature: -55 - 155°C; ComponentLink1Description: Datasheet; Pin Count: 2; Manufacturer: Uniroyal; ComponentLink1URL: https://datasheet.lcsc.com/szlcsc/1811062009_UNI-ROYAL-Uniroyal-Elec-0603WAF1002T5E_C25804.pdf; LCSC Part Number: C25792
R424 = CMP-010-000309-12: Resistor 1K2 0402 ±1% Thick Film Uniroyal; Temperature Coefficient: ±100ppm/K; Working Voltage: 50V; ComponentLink1Description: Datasheet; LCSC Part Number: C25862; ComponentLink1URL: https://datasheet.lcsc.com/szlcsc/1811062009_UNI-ROYAL-Uniroyal-Elec-0603WAF1002T5E_C25804.pdf; Temperature: -55 - 155°C; Pin Count: 2; Manufacturer: Uniroyal
R425 = CMP-010-000301-12: Resistor 12K 0402 ±1% Thick Film Uniroyal; Temperature Coefficient: ±100ppm/K; Working Voltage: 50V; ComponentLink1URL: https://datasheet.lcsc.com/szlcsc/1811062009_UNI-ROYAL-Uniroyal-Elec-0603WAF1002T5E_C25804.pdf; LCSC Part Number: C25752; Pin Count: 2; Manufacturer: Uniroyal; ComponentLink1Description: Datasheet; Temperature: -55 - 155°C
R442 = CMP-010-000293-9: Resistor 10K 0603 ±1% Thick Film Uniroyal; Temperature Coefficient: ±100ppm/K; Working Voltage: 75V; Manufacturer: Uniroyal; LCSC Part Number: C25804; ComponentLink1URL: https://datasheet.lcsc.com/szlcsc/1811062009_UNI-ROYAL-Uniroyal-Elec-0603WAF1002T5E_C25804.pdf; Pin Count: 2; Temperature: -55 - 155°C; ComponentLink1Description: Datasheet
R443 = CMP-010-000308-11: Resistor 1K0 0603 ±1% Thick Film Uniroyal; Working Voltage: 75V; Temperature Coefficient: ±100ppm/K; ComponentLink1URL: https://datasheet.lcsc.com/szlcsc/1811062009_UNI-ROYAL-Uniroyal-Elec-0603WAF1002T5E_C25804.pdf; LCSC Part Number: C21190; Pin Count: 2; Manufacturer: Uniroyal; ComponentLink1Description: Datasheet; Temperature: -55 - 155°C
U400 = CMP-051-000054-5: STM32G Series 128kB Flash 36kB RAM LQFP-48; LCSC Part Number: C529338; RoHS: Yes; ComponentLink1Description: Product Page; ComponentLink3Description: Hardware Development; ComponentLink2URL: https://www.st.com/resource/en/datasheet/stm32g070cb.pdf; ComponentLink1URL: https://www.st.com/en/microcontrollers-microprocessors/stm32g0x0-value-line.html; ComponentLink3URL: https://www.st.com/resource/en/application_note/dm00443870-getting-started-with-stm32g0-series-hardware-development-stmicroelectronics.pdf; ComponentLink2Description: Datasheet
U401 = CMP-000036-4: Voltage Supervisor 45 uA 3V3 SOT23-3; Min Reset Threshold Voltage: 2.85V; Min Supply Voltage: 1V; Max Supply Voltage: 5.5V; Max Supply Current: 60uA; Accuracy: -5%; Quiescent Current: 45uA; Max Reset Threshold Voltage: 3V; Height: 0.95mm; RoHS Compliant: Yes; Case/Package: SOT-23; Min Operating Temperature: -40°C; ComponentLink1URL: https://ww1.microchip.com/downloads/en/DeviceDoc/11184d.pdf; Max Operating Temperature: 85°C; ComponentLink1Description: Datasheet; LCSC Part Number: C410526; Package Quantity: 1
U402 = CMP-061-000002-1: Temperature Switch Open Drain Hot & Cold 0.5-µA Resistor Programmable SOT56-3 -55 to 130C; Manufacturer: Texas Instruments; Package: SOT56-3; ComponentLink1URL: https://www.ti.com/lit/ds/symlink/tmp390.pdf?HQS=dis-dk-null-digikeymode-dsf-pf-null-wwe&ts=1631180560126&ref_url=https%253A%252F%252Fwww.ti.com%252Fgeneral%252Fdocs%252Fsuppproductinfo.tsp%253FdistId%253D10%2526gotoUrl%253Dhttps%253A%252F%252Fwww.ti.com%252Flit%252Fgpn%252Ftmp390; ComponentLink1Description: Datasheet
Y400 = CMP-003-00000-3: Crystal 32.768KHZ 12.5PF SMD; Frequency Tolerance: ±20ppm; Load Capacitance: 12.5pF; Min Operating Temperature: -40°C; Max Operating Temperature: 85°C; Package: 3215; ComponentLink1Description: Datasheet; ComponentLink1URL: http://www.txccorp.com/download/products/quartz_crystals/2015TXC_9HT10_31.pdf

## Sheet RS485 Tranciever.SchDoc: RS485 Tranciever
size A4; ApprovedBy: LD Stanton; Author: LD Stanton; CompanyName: University of Cape Town; DrawnBy: Lawrence Stanton; Engineer: Lawrence Stanton; Organization: University of Cape Town; Address1: Department of Electrical Engineering; Address2: Rondebosch; Address3: Cape Town; Address4: South Africa 7701; DocumentNumber: 14; SheetNumber: 14; SheetTotal: 20
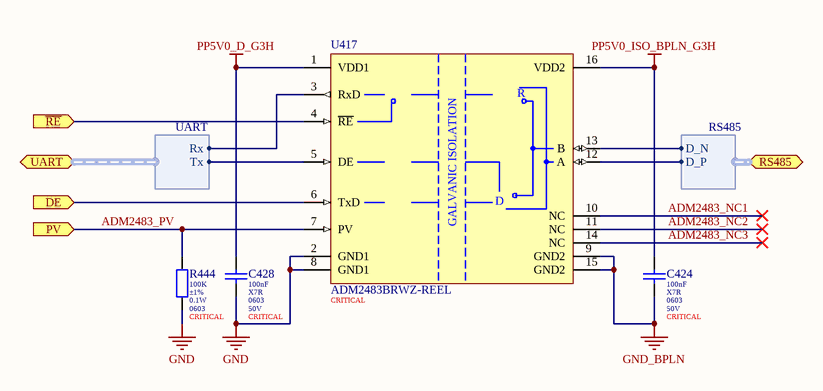
[diagram p3: RS485 Tranciever.SchDoc]

### Parts
C424  value 100nF  Dielectric: X7R  Package: 0603  Voltage: 50V  Populate: CRITICAL  [0603 (Yageo DA) B]  (hidden comment: CC0603KRX7R9BB104)
C428  value 100nF  Dielectric: X7R  Package: 0603  Voltage: 50V  Populate: CRITICAL  [0603 (Yageo DA) B]  (hidden comment: CC0603KRX7R9BB104)
R444  value 100K  Tolerance: ±1%  Power: 0.1W  Package: 0603  Populate: CRITICAL  [0603 (Uniroyal) B]  (hidden comment: 0603WAF1003T5E)
U417  ADM2483BRWZ-REEL  Placement: CRITICAL  [SOIC-16 (ADM2483) B]

### Ports
DE (in), PV (in), RS485 (bidir, harness RS485), UART (bidir, harness UART), ~{RE} (in)

### Harnesses
RS485: D_N, D_P
UART: Rx, Tx

### Nets
GND: C428.2 R444.2 U417.2(GND1) U417.8(GND1)
GND_BPLN: C424.2 U417.9(GND2) U417.15(GND2)
PP5V0_D_G3H: C428.1 U417.1(VDD1)
PP5V0_ISO_BPLN_G3H: C424.1 U417.16(VDD2)
ADM2483_NC1: U417.10(NC)
ADM2483_NC2: U417.11(NC)
ADM2483_NC3: U417.14(NC)
ADM2483_PV: R444.1 U417.7(PV) ; port PV  [project net MCU_UART1_PV]
MCU_UART1_DE: U417.4(~{RE}) U417.6(TxD) ; port ~{RE}, port DE
RS485.D_N: U417.13(B) ; port RS485.D_N
RS485.D_P: U417.12(A) ; port RS485.D_P
UART1.Rx: U417.3(RxD) ; port UART.Rx
UART1.Tx: U417.5(DE) ; port UART.Tx

### Notes on the sheet
- Size:
- Date:
- A4
- Number:
- Time:
- Revision:
- Sheet
- of
- File:
- Author:
- (in symbol CMP-015-00000-6) R; GALVANIC ISOLATION; D

### Library data of the parts
C424 C428 = CMP-047-000000-7: MLCC 100nF 50V 0603 X7R ±10%; Manufacturer: Yageo; LCSC Part Number: C14663; Tolerance: ±10%; ComponentLink1URL: https://datasheet.lcsc.com/szlcsc/YAGEO-CC0603KRX7R9BB104_C14663.pdf; ComponentLink1Description: Datasheet
R444 = CMP-010-000288-10: as R412 on sheet MCU; Manufacturer: Uniroyal; ComponentLink1URL: https://datasheet.lcsc.com/szlcsc/1811062009_UNI-ROYAL-Uniroyal-Elec-0603WAF1002T5E_C25804.pdf; LCSC Part Number: C25803; Temperature: -55 - 155°C; ComponentLink1Description: Datasheet; Pin Count: 2
U417 = CMP-015-00000-6: Single Transmitter/Receiver RS-485 16-Pin SOIC W T/R; Min Supply Voltage: 2.7V; Max Supply Voltage: 5.5V; Data Rate: 500Kbps; Operating Supply Voltage: 5V; Isolation Voltage: 2.5kV; Operating Supply Current: 2.5mA; LCSC Part Number: C9637; ComponentLink1URL: https://datasheet.lcsc.com/lcsc/1810181111_Analog-Devices-ADM2483BRWZ-REEL_C9637.pdf; Case/Package: SOIC; Max Operating Temperature: 85°C; RoHS Compliant: Yes; Min Operating Temperature: -40°C; ComponentLink1Description: Datasheet

## Sheet EEPROM.SchDoc: EEPROM
size A4; ApprovedBy: LD Stanton; Author: LD Stanton; CompanyName: University of Cape Town; DrawnBy: Lawrence Stanton; Engineer: Lawrence Stanton; Organization: University of Cape Town; Address1: Department of Electrical Engineering; Address2: Rondebosch; Address3: Cape Town; Address4: South Africa 7701; DocumentNumber: 12; SheetNumber: 12; SheetTotal: 20
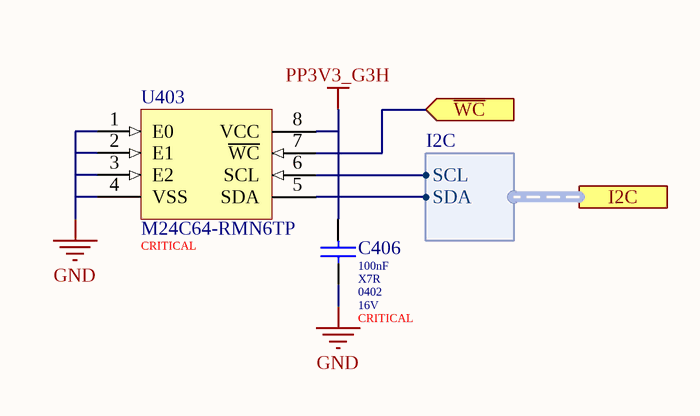
[diagram p4: EEPROM.SchDoc]

### Parts
C406  value 100nF  Dielectric: X7R  Package: 0402  Voltage: 16V  Populate: CRITICAL  [0402_050_5 (Samsumg) B]  (hidden comment: CL05B104KO5NNNC)
U403  M24C64-RMN6TP  Placement: CRITICAL  [SO8N (M24) B]

### Ports
I2C (harness I2C), ~{WC} (in)

### Harnesses
I2C: SCL, SDA

### Nets
GND: C406.2 U403.1(E0) U403.2(E1) U403.3(E2) U403.4(VSS)
PP3V3_G3H: C406.1 U403.8(VCC)
~{EEPROM_WC}: U403.7(~{WC}) ; port ~{WC}
I2C1.SCL: U403.6(SCL) ; port I2C.SCL
I2C1.SDA: U403.5(SDA) ; port I2C.SDA

### Notes on the sheet
- Size:
- Date:
- A4
- Number:
- Time:
- Revision:
- Sheet
- of
- File:
- Author:

### Library data of the parts
C406 = CMP-045-000014-12: as C401 on sheet MCU; ComponentLink1Description: Datasheet; ComponentLink1URL: https://datasheet.lcsc.com/szlcsc/Samsung-Electro-Mechanics-CL05C100JB5NNNC_C32949.pdf; LCSC Part Number: C1525; Tolerance: ±10%
U403 = CMP-001-0001-4: IC EEPROM 64KBIT 1MHZ 8TSSOP; Manufacturer: STMicroelectronics; Manufacturer Part Number: M24512-RDW6TP; Ibis Model: M24C32; Nominal Supply Current: 3mA; Min Supply Voltage: 1.8V; Interface: I2C; Max Frequency: 400kHz; Density: 64Kb; Operating Supply Voltage: 5V; Max Supply Voltage: 5.5V; Access Time: 900ns; Component Type: Standard; Mount: Surface Mount; Number of Pins: 8; ComponentLink2Description: Product Page; ComponentLink1URL: https://www.st.com/resource/en/datasheet/m24c64-r.pdf; LCSC Part Number: C79988; Lead Free: Lead Free; Radiation Hardening: No; RoHS: Yes; Case/Package: SOIC; ComponentLink1Description: Datasheet; ComponentLink2URL: https://www.st.com/en/memories/m24c64-r.html; Package Quantity: 2500; Pricing 2: 1=0,32900, 10=0,32900, 25=0,32900, 50=0,32900, 100=0,30200, 250=0,30200, 500=0,30200, 1000=0,30200 (USD); Category: EEPROM; Pin Count: 8; Stock 2: 540; Memory Type: EEPROM; Memory Size: 64Kb; Max Operating Temperature: 85°C; Packaging: Tape and Reel; Min Operating Temperature: -40°C; Design Item ID: M24512-RMN6TP; Source: M24.SchLib

## Sheet Sensors.SchDoc: Sensors
size A4; ApprovedBy: LD Stanton; Author: LD Stanton; CompanyName: University of Cape Town; DrawnBy: Lawrence Stanton; Engineer: Lawrence Stanton; Organization: University of Cape Town; Address1: Department of Electrical Engineering; Address2: Rondebosch; Address3: Cape Town; Address4: South Africa 7701; DocumentNumber: 13; SheetNumber: 13; SheetTotal: 20
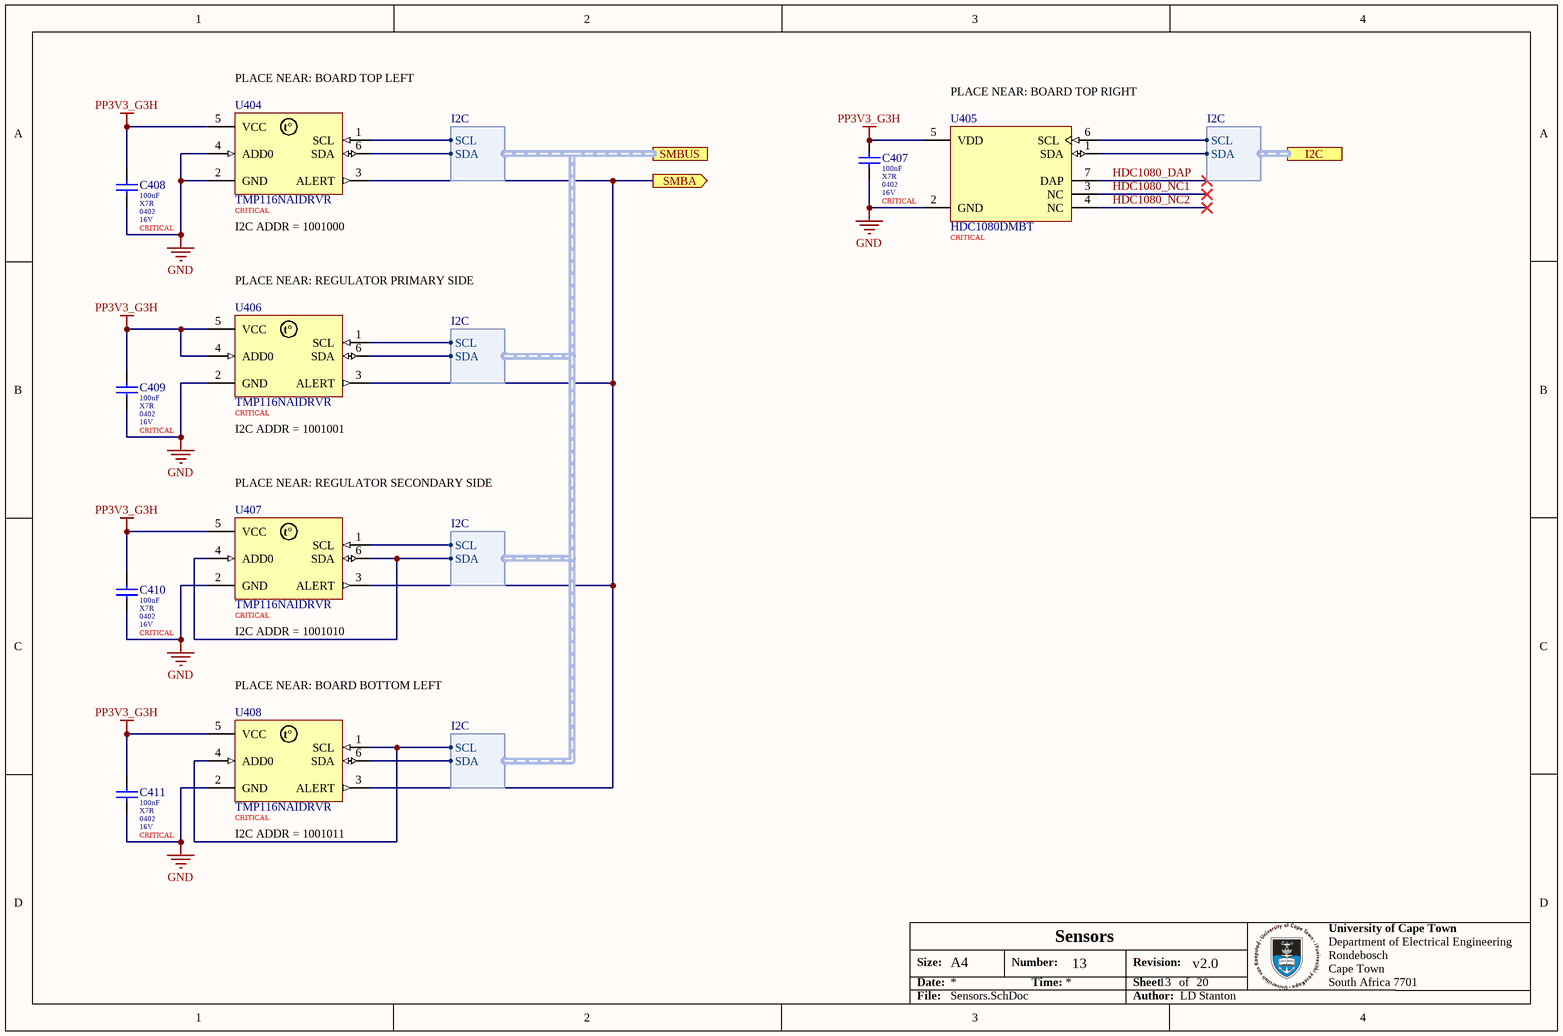
[diagram p5: Sensors.SchDoc]

### Parts
C407  value 100nF  Dielectric: X7R  Package: 0402  Voltage: 16V  Populate: CRITICAL  [0402_050_5 (Samsumg) B]  (hidden comment: CL05B104KO5NNNC)
C408  value 100nF  Dielectric: X7R  Package: 0402  Voltage: 16V  Populate: CRITICAL  [0402_050_5 (Samsumg) B]  (hidden comment: CL05B104KO5NNNC)
C409  value 100nF  Dielectric: X7R  Package: 0402  Voltage: 16V  Populate: CRITICAL  [0402_050_5 (Samsumg) B]  (hidden comment: CL05B104KO5NNNC)
C410  value 100nF  Dielectric: X7R  Package: 0402  Voltage: 16V  Populate: CRITICAL  [0402_050_5 (Samsumg) B]  (hidden comment: CL05B104KO5NNNC)
C411  value 100nF  Dielectric: X7R  Package: 0402  Voltage: 16V  Populate: CRITICAL  [0402_050_5 (Samsumg) B]  (hidden comment: CL05B104KO5NNNC)
U404  TMP116NAIDRVR  Placement: CRITICAL  [SON (DRV0006B) B]
U405  HDC1080DMBT  Placement: CRITICAL  [HDC1080 B]
U406  TMP116NAIDRVR  Placement: CRITICAL  [SON (DRV0006B) B]
U407  TMP116NAIDRVR  Placement: CRITICAL  [SON (DRV0006B) B]
U408  TMP116NAIDRVR  Placement: CRITICAL  [SON (DRV0006B) B]

### Ports
I2C (harness I2C), SMBA (out), SMBUS (harness I2C)

### Harnesses
I2C: SCL, SDA

### Nets
GND: C407.2 C408.2 C409.2 C410.2 C411.2 U404.2(GND) U404.4(ADD0) U405.2(GND) U406.2(GND) U407.2(GND) U408.2(GND)
PP3V3_G3H: C407.1 C408.1 C409.1 C410.1 C411.1 U404.5(VCC) U405.5(VDD) U406.4(ADD0) U406.5(VCC) U407.5(VCC) U408.5(VCC)
HDC1080_DAP: U405.7(DAP)
HDC1080_NC1: U405.3(NC)
HDC1080_NC2: U405.4(NC)
I2C1.SCL: U404.1(SCL) U405.6(SCL) U406.1(SCL) U407.1(SCL) U408.1(SCL) U408.4(ADD0) ; port SMBUS.SCL
I2C1.SDA: U404.6(SDA) U405.1(SDA) U406.6(SDA) U407.4(ADD0) U407.6(SDA) U408.6(SDA) ; port SMBUS.SDA
MCU_SMBA: U404.3(ALERT) U406.3(ALERT) U407.3(ALERT) U408.3(ALERT) ; port SMBA

### Notes on the sheet
- (near U404) PLACE NEAR: BOARD TOP LEFT
- (near U405) PLACE NEAR: BOARD TOP RIGHT
- (near U404) I2C ADDR = 1001000
- (near U406) PLACE NEAR: REGULATOR PRIMARY SIDE
- (near U406) I2C ADDR = 1001001
- (near U407) PLACE NEAR: REGULATOR SECONDARY SIDE
- (near U407) I2C ADDR = 1001010
- (near U408) PLACE NEAR: BOARD BOTTOM LEFT
- (near U408) I2C ADDR = 1001011
- Size:
- Date:
- A4
- Number:
- Time:
- Revision:
- Sheet
- of
- File:
- Author:
- (in symbol CMP-061-000004-2) t°

### Library data of the parts
C407-C411 = CMP-045-000014-12: as C401 on sheet MCU; ComponentLink1Description: Datasheet; ComponentLink1URL: https://datasheet.lcsc.com/szlcsc/Samsung-Electro-Mechanics-CL05C100JB5NNNC_C32949.pdf; LCSC Part Number: C1525; Tolerance: ±10%
U404 U406-U408 = CMP-061-000004-2: Digital Temperature Sensor ±0.2°C NV Memory 6-WSON -55 to 125°C; Manufacturer: Texas Instruments; Interface: I2C,SMBus,2-Wire; Resolution: 16b; LCSC Part Number: C182074; ComponentLink1URL: https://www.ti.com/lit/ds/symlink/tmp116.pdf?ts=1635336236311&ref_url=https%253A%252F%252Fwww.google.com%252F; ComponentLink1Description: Datasheet; Max Operating Temperature: 150°C; Package: SON-6; Min Operating Temperature: -55°C
U405 = CMP-061-000003-1: TEXAS INSTRUMENTS - HDC1080DMBT - Feuchtigkeitssensor, Messbereich 0% bis 100% rF, I2C, digital, 2.7V bis 5.5V, WSON-6; Accuracy: 2%; Response Time: 15s; LCSC Part Number: C82227; ComponentLink2Description: Product Page; ComponentLink1Description: Datasheet; ComponentLink1URL: https://www.ti.com/lit/ds/symlink/hdc1080.pdf?ts=1632753961560&ref_url=https%253A%252F%252Fwww.ti.com%252Fproduct%252FHDC1080; Min Operating Temperature: -40°C; Lead Free: Lead Free; ComponentLink2URL: https://www.ti.com/product/HDC1080; Interface: I2C; RoHS Compliant: Yes; Max Operating Temperature: 125°C

## Sheet Connectors.SchDoc: Connectors
size A4; ApprovedBy: LD Stanton; CheckedBy: None; Author: LD Stanton; CompanyName: University of Cape Town; DrawnBy: Lawrence Stanton; Engineer: Lawrence Stanton; Organization: University of Cape Town; Address1: Department of Electrical Engineering; Address2: Rondebosch; Address3: Cape Town; Address4: South Africa 7701; DocumentNumber: 3; SheetNumber: 3; SheetTotal: 20; Approv_Date_Eng: --/--/----; Approv_Date_Chk: --/--/----; PCB_Doc: TBD; ASM_Doc: TBD; FAB_Doc: TBD; CML_Doc: TBD; BOM_Doc: TBD
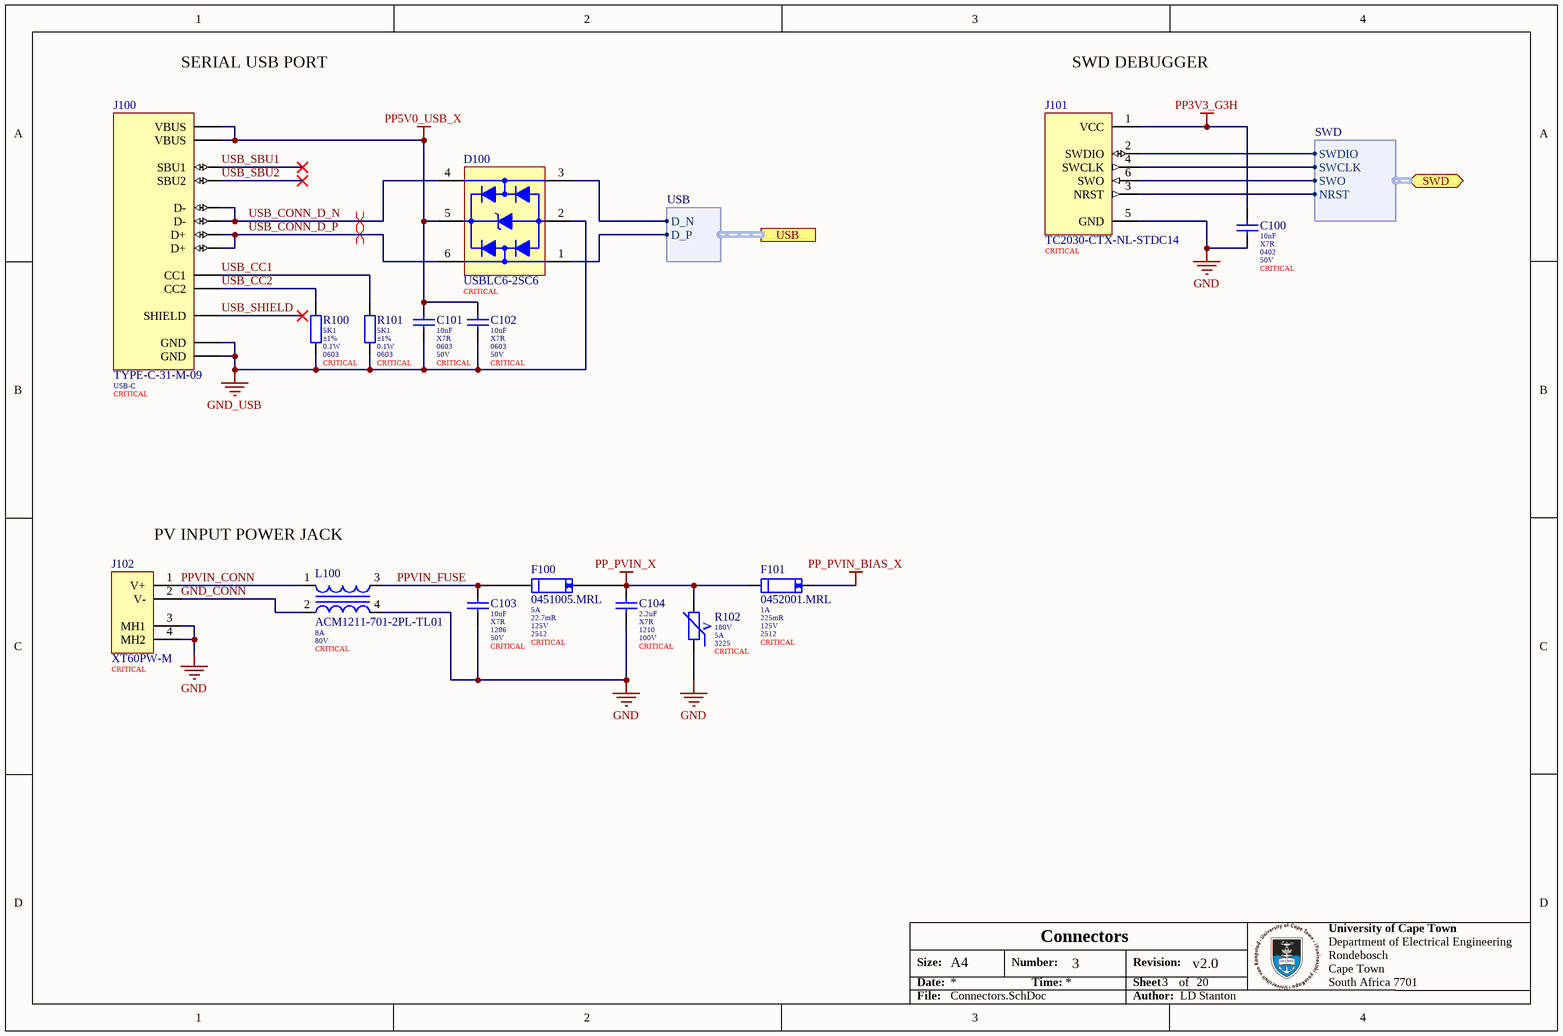
[diagram p6: Connectors.SchDoc]

### Parts
(Parts that share a designator on the sheet are numbered #1, #2 ... from top to bottom, then left to right.)
C100  value 10nF  Dielectric: X7R  Package: 0402  Voltage: 50V  Populate: CRITICAL  [0402_050_5 (Samsumg) B]  (hidden comment: CL05B103KB5NNNC)
C101  value 10nF  Dielectric: X7R  Package: 0603  Voltage: 50V  Populate: CRITICAL  [0603_080 (Guandong) B]  (hidden comment: 0603B103K500NT)
C102  value 10nF  Dielectric: X7R  Package: 0603  Voltage: 50V  Populate: CRITICAL  [0603_080 (Guandong) B]  (hidden comment: 0603B103K500NT)
C103#1  value 10nF  Dielectric: X7R  Package: 1206  Voltage: 50V  Populate: CRITICAL  [1206_125 (Guandong) B]  (hidden comment: 1206B103K500NT)
C104#1  value 2.2uF  Dielectric: X7R  Package: 1210  Voltage: 100V  Populate: CRITICAL  [1212_250_J (Samsumg) B]  (hidden comment: CL32B225KCJSNNE)
D100  USBLC6-2SC6  Placement: CRITICAL  [SOT-23-6 (USBLC6-2SC6 ST) B]
F100#1  0451005.MRL  Current: 5A  Resistance: 22.7mR  Voltage: 125V  Package: 2512  Placement: CRITICAL  [Littlefuse 45x B]
F101#1  0452001.MRL  Current: 1A  Resistance: 225mR  Voltage: 125V  Package: 2512  Placement: CRITICAL  [Littlefuse 45x B]
J100  TYPE-C-31-M-09  Type: USB-C  Placement: CRITICAL  [TYPE-C-31-M-09_OVH]
J101  TC2030-CTX-NL-STDC14  Placement: CRITICAL  [TC2030 NL]  (no BOM)
J102  XT60PW-M  Placement: CRITICAL  [XT60-PW_OVH]
L100#1  ACM1211-701-2PL-TL01  Current: 8A  Voltage: 80V  Placement: CRITICAL  [ACM1211]
R100  value 5K1  Tolerance: ±1%  Power: 0.1W  Package: 0603  Populate: CRITICAL  [0603 (Uniroyal) B]  (hidden comment: 0603WAF5101T5E)
R101  value 5K1  Tolerance: ±1%  Power: 0.1W  Package: 0603  Populate: CRITICAL  [0603 (Uniroyal) B]  (hidden comment: 0603WAF5101T5E)
R102#1  Varistor Voltage: 180V  Clamping Current: 5A  Package: 3225  Placement: CRITICAL  [3225 (B726) B]  (hidden comment: B72650M0111K072)

### Ports
SWD (bidir, harness SWD), USB (harness USB)

### Harnesses
USB: D_P, D_N
SWD: SWCLK, SWDIO, NRST, SWO

### Nets
GND: C100.2 C103#1.2 C104#1.2 J101.5(GND) J102.3(MH1) J102.4(MH2) L100#1.4 R102#1.1
GND_USB: C101.2 C102.2 D100.2(GND) J100.A1B12(GND) J100.B1A12(GND) R100.2 R101.2
PP3V3_G3H: C100.1 J101.1(VCC)
PP5V0_USB_X: C101.1 C102.1 D100.5(VBUS) J100.A4B9(VBUS) J100.B4A9(VBUS)
PP_PVIN_BIAS_X: F101#1.2
PP_PVIN_X: C104#1.1 F100#1.2 F101#1.1 R102#1.2
GND_CONN: J102.2(V-) L100#1.2
PPVIN_CONN: J102.1(V+) L100#1.1
PPVIN_FUSE: C103#1.1 F100#1.1 L100#1.3
SWD.NRST: J101.3(NRST) ; port SWD.NRST
SWD.SWCLK: J101.4(SWCLK) ; port SWD.SWCLK
SWD.SWDIO: J101.2(SWDIO) ; port SWD.SWDIO
SWD.SWO: J101.6(SWO) ; port SWD.SWO
USB.D_N: D100.3(I/O_2) ; port USB.D_N
USB.D_P: D100.1(I/O_1) ; port USB.D_P
USB_CC1: J100.A5(CC1) R101.1
USB_CC2: J100.B5(CC2) R100.1
USB_CONN_D_N: D100.4(I/O_3) J100.A7(D-) J100.B7(D-)
USB_CONN_D_P: D100.6(I/O_4) J100.A6(D+) J100.B6(D+)
USB_SBU1: J100.A8(SBU1)
USB_SBU2: J100.B8(SBU2)
USB_SHIELD: J100.1(SHIELD)

### Layout directives
differential pair: USB_CONN_D_N, USB_CONN_D_P

### Notes on the sheet
- SERIAL USB PORT
- SWD DEBUGGER
- PV INPUT POWER JACK
- Size:
- Date:
- A4
- Number:
- Time:
- Revision:
- Sheet
- of
- File:
- Author:
- (in symbol CMP-000045-3) V

### Library data of the parts
C100 = CMP-045-000005-9: MLCC 10nF 0402 50V X7R ±10%; Manufacturer: Samsung; ComponentLink1URL: https://datasheet.lcsc.com/szlcsc/Samsung-Electro-Mechanics-CL05C100JB5NNNC_C32949.pdf; Tolerance: ±10%; LCSC Part Number: C15195; ComponentLink1Description: Datasheet
C101 C102 = CMP-014-000000-11: MLCC 10nF 0603 50V X7R ±10%; Manufacturer: Guandong; Tolerance: ±15%; ComponentLink1Description: Datasheet; LCSC Part Number: C57112; ComponentLink1URL: https://datasheet.lcsc.com/szlcsc/Guangdong-Fenghua-Advanced-Tech-0402B102K500NT_C1523.pdf
C103#1 = CMP-014-000019-1: MLCC 10nF 1206 50V X7R ±10%; Manufacturer: Guandong; ComponentLink1URL: https://datasheet.lcsc.com/szlcsc/Guangdong-Fenghua-Advanced-Tech-0402B102K500NT_C1523.pdf; Tolerance: ±10%; LCSC Part Number: C1846; ComponentLink1Description: Datasheet
C104#1 = CMP-014-000010-1: MLCC 2.2uF 1210 100V X7R ±10%; Manufacturer: Samsung; LCSC Part Number: C55151; Tolerance: ±10%; ComponentLink1URL: https://datasheet.lcsc.com/szlcsc/Samsung-Electro-Mechanics-CL05C100JB5NNNC_C32949.pdf; ComponentLink1Description: Datasheet
D100 = CMP-004-00000-1: TVS Diode Array Low Capacitance SOT23-6; Manufacturer: Tech Public; Peak Pulse Current: 5A; Breakdown Voltage: 6V; Leakage Current: 150nA; Capacitance: 3.5pF; Data Rate: 480Mbps; Clamping Voltage: 17V; Max Operating Temperature: 125°C; Case/Package: SOT-23-6; ComponentLink1URL: https://datasheet.lcsc.com/lcsc/2108132230_TECH-PUBLIC-USBLC6-2SC6_C2827654.pdf; ComponentLink1Description: Datasheet; Min Operating Temperature: -40°C; RoHS Compliant: Yes; LCSC Part Number: C2827654
F100#1 = CMP-005-00002-1: Fuse 5A 125VAC/VDCSMD Littlefuse; Body Material: Ceramic; LCSC Part Number: C48467; Max Operating Temperature: 125°C; ComponentLink1Description: Datasheet; ComponentLink1URL: https://datasheet.lcsc.com/lcsc/1809291113_Littelfuse-0451010.MRL_C44479.pdf; Min Operating Temperature: -55°C; RoHS Compliant: Yes
F101#1 = CMP-005-00001-1: Fuse 1A 125VAC/VDC SMD Littlefuse; Body Material: Ceramic; RoHS Compliant: Yes; Max Operating Temperature: 125°C; Min Operating Temperature: -55°C; ComponentLink1URL: https://datasheet.lcsc.com/lcsc/1809191823_Littelfuse-0452001.MRL_C44669.pdf; LCSC Part Number: C44669; ComponentLink1Description: Datasheet
J100 = CMP-016-000003-6: USB Type C Jack USB2.0 SMD/TH; LCSC Part Number: C2689967; ComponentLink1URL: https://datasheet.lcsc.com/lcsc/2103221609_Korean-Hroparts-Elec-TYPE-C-31-M-09_C2689967.pdf; ComponentLink1Description: Drawing
J101 = CMP-000037-4: 6-Pin Plug-of-nails connector for SWD; ComponentLink1Description: Datasheet; ComponentLink1URL: https://www.tag-connect.com/wp-content/uploads/bsk-pdf-manager/TC2030-CTX_1.pdf
J102 = CMP-000030-3: DC Power Connector 500V 30A 0.50mR; DC Resistance: 0.5mR; Peak Current: 60A; LCSC Part Number: C98732; Insulation Rating: 500V; ComponentLink1URL: https://datasheet.lcsc.com/lcsc/1810251313_Changzhou-Amass-Elec-XT60PW-M_C98732.pdf; Rated Current: 30A; ComponentLink1Description: Datasheet
L100#1 = CMP-000044-4: Common Mode Choke 6mR 80V 8A 700R @ 100MHz; Min Operating Temperature: -40°C; Impedance: 700R; RoHS Compliant: Yes; Max Operating Temperature: 85°C; LCSC Part Number: C250214
R100 R101 = CMP-010-000393-1: Resistor 5K1 0603 ±1% Thick Film Uniroyal; Temperature Coefficient: ±100ppm/K; Working Voltage: 50V; LCSC Part Number: C23186; Pin Count: 2; Manufacturer: Uniroyal; Temperature: -55 - 155°C; ComponentLink1Description: Datasheet; ComponentLink1URL: https://datasheet.lcsc.com/szlcsc/1811062009_UNI-ROYAL-Uniroyal-Elec-0603WAF1002T5E_C25804.pdf
R102#1 = CMP-000045-3: Varistor MLV 115VAC/150VDC Rated 400A Peak 180V Trigger 3225; Capacitance: 110pF; Max Surge Current: 100A; Voltage Rating (AC): 115V; Voltage Rating (DC): 150V; Clamping Voltage: 36V; Min Operating Temperature: -40°C; Max Operating Temperature: 85°C; Max Voltage Rating (DC): 150V; RoHS Compliant: Yes; LCSC Part Number: C211089